# Altium project ideal V2.0.PrjPCB
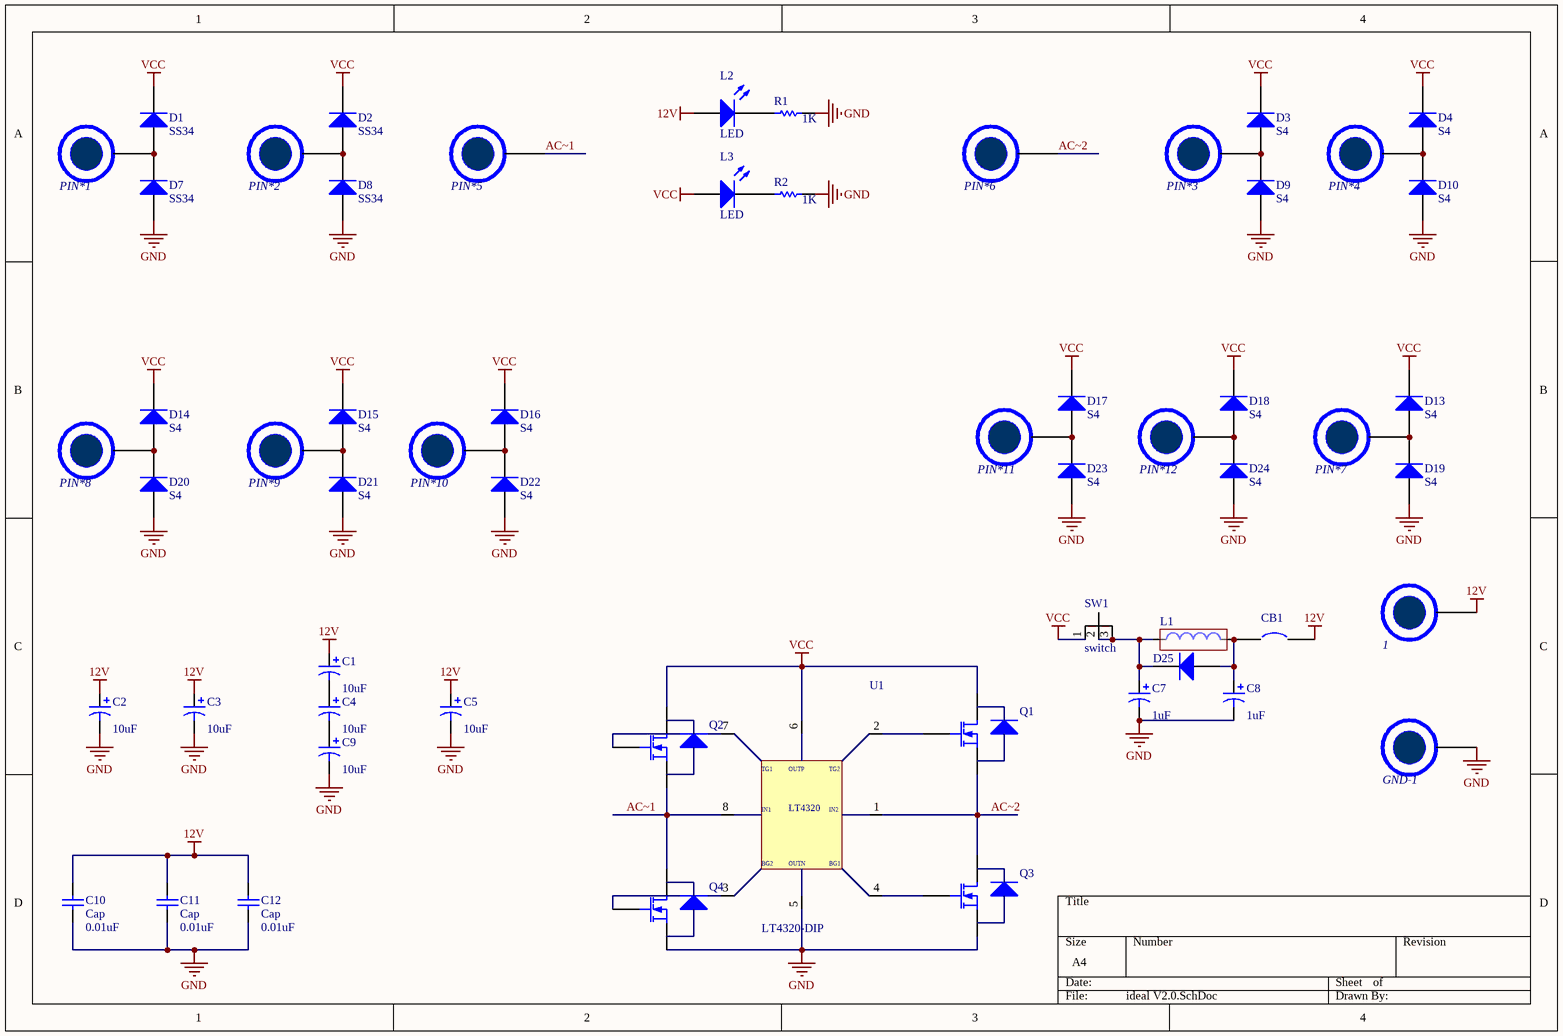
[diagram p0: ideal V2.0.SchDoc]
1 sheet, 58 parts. Net scope: global (net labels, ports and power ports of the same name join across sheets).
Board files: ideal V2.0.PcbDoc, 手工板.PcbDoc

## Sheet ideal V2.0.SchDoc
size A4

### Parts
1  PIN  [PIN]  (value not drawn)
C1  value 10uF  [法拉电容]  (hidden comment: Cap Pol1)
C2  value 10uF  [RB7.6-15]  (hidden comment: Cap Pol1)
C3  value 10uF  [RB7.6-15]  (hidden comment: Cap Pol1)
C4  value 10uF  [法拉电容]  (hidden comment: Cap Pol1)
C5  value 10uF  [RB7.6-15]  (hidden comment: Cap Pol1)
C7  value 1uF  [C2012]  (hidden comment: Cap Pol1)
C8  value 1uF  [C2012]  (hidden comment: Cap Pol1)
C9  value 10uF  [法拉电容]  (hidden comment: Cap Pol1)
C10  Cap  value 0.01uF  [C2012]
C11  Cap  value 0.01uF  [C2012]
C12  Cap  value 0.01uF  [C2012]
CB1  Circuit Breaker  [SPST-2]  (value not drawn)
D1  SS34  [1206(2)]
D2  SS34  [1206(2)]
D3  S4  [1206(2)]
D4  S4  [1206(2)]
D7  SS34  [1206(2)]
D8  SS34  [1206(2)]
D9  S4  [1206(2)]
D10  S4  [1206(2)]
D13  S4  [1206(2)]
D14  S4  [1206(2)]
D15  S4  [1206(2)]
D16  S4  [1206(2)]
D17  S4  [1206(2)]
D18  S4  [1206(2)]
D19  S4  [1206(2)]
D20  S4  [1206(2)]
D21  S4  [1206(2)]
D22  S4  [1206(2)]
D23  S4  [1206(2)]
D24  S4  [1206(2)]
D25  Diode 1N4001  [SK54]  (value not drawn)
GND-1  PIN  [PIN]  (value not drawn)
L1  33uH  [SMD-EC-F16]  (value not drawn)
L2  LED  [C2012]
L3  LED  [C2012]
PIN*1  PIN  [PIN]  (value not drawn)
PIN*2  PIN  [PIN]  (value not drawn)
PIN*3  PIN  [PIN]  (value not drawn)
PIN*4  PIN  [PIN]  (value not drawn)
PIN*5  PIN  [PIN]  (value not drawn)
PIN*6  PIN  [PIN]  (value not drawn)
PIN*7  PIN  [PIN]  (value not drawn)
PIN*8  PIN  [PIN]  (value not drawn)
PIN*9  PIN  [PIN]  (value not drawn)
PIN*10  PIN  [PIN]  (value not drawn)
PIN*11  PIN  [PIN]  (value not drawn)
PIN*12  PIN  [PIN]  (value not drawn)
Q1  MOSFET-N  [mos]  (value not drawn)
Q2  MOSFET-N  [mos]  (value not drawn)
Q3  MOSFET-N  [mos]  (value not drawn)
Q4  MOSFET-N  [mos]  (value not drawn)
R1  value 1K  [R2012]  (hidden comment: Res)
R2  value 1K  [R2012]  (hidden comment: Res)
SW1  switch  [SW-125V6A(-)]
U1  LT4320-DIP  [DIP-8]

### Nets
12V: 1.1(PIN) C1.1 C2.1 C3.1 C5.1 C10.2 C11.2 C12.2 CB1.2 L2.1(A)
GND: C2.2 C3.2 C5.2 C7.2 C8.2 C9.2 C10.1 C11.1 C12.1 D7.1(A) D8.1(A) D9.1(A) D10.1(A) D19.1(A) D20.1(A) D21.1(A) D22.1(A) D23.1(A) D24.1(A) GND-1.1(PIN) Q3.3(S) Q4.3(S) R1.2 R2.2 U1.5
VCC: D1.2(K) D2.2(K) D3.2(K) D4.2(K) D13.2(K) D14.2(K) D15.2(K) D16.2(K) D17.2(K) D18.2(K) L3.1(A) Q1.2(D) Q2.2(D) SW1.1 U1.6
AC~1: PIN*5.1(PIN) Q2.3(S) Q4.2(D) U1.8
AC~2: PIN*6.1(PIN) Q1.3(S) Q3.2(D) U1.1
NetC1_2: C1.2 C4.1
NetC4_2: C4.2 C9.1
NetC7_1: C7.1 D25.2(K) L1.1 SW1.2 SW1.3
NetC8_1: C8.1 CB1.1 D25.1(A) L1.2
NetD1_1: D1.1(A) D7.2(K) PIN*1.1(PIN)
NetD2_1: D2.1(A) D8.2(K) PIN*2.1(PIN)
NetD3_1: D3.1(A) D9.2(K) PIN*3.1(PIN)
NetD4_1: D4.1(A) D10.2(K) PIN*4.1(PIN)
NetD13_1: D13.1(A) D19.2(K) PIN*7.1(PIN)
NetD14_1: D14.1(A) D20.2(K) PIN*8.1(PIN)
NetD15_1: D15.1(A) D21.2(K) PIN*9.1(PIN)
NetD16_1: D16.1(A) D22.2(K) PIN*10.1(PIN)
NetD17_1: D17.1(A) D23.2(K) PIN*11.1(PIN)
NetD18_1: D18.1(A) D24.2(K) PIN*12.1(PIN)
NetL2_2: L2.2(K) R1.1
NetL3_2: L3.2(K) R2.1
NetQ1_1: Q1.1(G) U1.2
NetQ2_1: Q2.1(G) U1.7
NetQ3_1: Q3.1(G) U1.4
NetQ4_1: Q4.1(G) U1.3

### Notes on the sheet
- (in symbol LT4320-DIP) TG1; OUTP; TG2; IN1; LT4320; IN2; BG2; OUTN; BG1

### Library data of the parts
C1-C5 C7-C9 = Cap Pol1: Polarized Capacitor (Radial); Published: 8-Jun-2000; LatestRevisionDate: 17-Jul-2002; LatestRevisionNote: Re-released for DXP Platform.; PackageReference: RB7.6-15; Publisher: Altium Limited; PackageDescription: Polarized Capacitor (Radial); 2 Leads
C10-C12 = Cap: Capacitor; Published: 8-Jun-2000; LatestRevisionDate: 17-Jul-2002; LatestRevisionNote: Re-released for DXP Platform.; PackageReference: RAD-0.3; Publisher: Altium Limited; PackageDescription: Radial Cap, Thru-Hole; 2 Leads; 0.3 in Pin Spacing
D1-D4 D7-D10 D13-D24 = Diode 1N4148: High Conductance Fast Diode; LatestRevisionDate: 17-Jul-2002; LatestRevisionNote: Re-released for DXP Platform.; DatasheetDocument: 1997; PackageReference: DO-35; Publisher: Altium Limited; Code_JEDEC: DO-204-AH; ComponentLink1Description: Manufacturer Link; ComponentLink2Description: Datasheet; ComponentLink2URL: http://www.fairchildsemi.com/ds/1N%2F1N4148.pdf
D25 = Diode 1N4001: 1 Amp General Purpose Rectifier; Published: 8-Jun-2000; LatestRevisionDate: 17-Jul-2002; LatestRevisionNote: Re-released for DXP Platform.; DatasheetVersion: 1998; PackageVersion: Aug-1999; PackageReference: DO-41; Publisher: Altium Limited; PackageDescription: Diode, Axial; Body 5.2 x 2.7 mm (LxDia. max), Lead Dia. 0.86 mm (max); Code_JEDEC: DO-204-AL; ComponentLink1Description: Manufacturer Link; ComponentLink1URL: http://www.fairchildsemi.com/; ComponentLink2Description: Datasheet; ComponentLink2URL: http://www.fairchildsemi.com/ds/1N%2F1N4001.pdf
L1 = Inductor
Q1-Q4 = MOSFET-N: N-Channel MOSFET; PackageDocument: 1995/1996; Published: 8-Jun-2000; LatestRevisionDate: 17-Jul-2002; LatestRevisionNote: Re-released for DXP Platform.; PackageReference: E3; Publisher: Altium Limited
R1 R2 = Res: 贴片电阻; Published: 8-Jun-2000; LatestRevisionDate: 17-Jul-2002; LatestRevisionNote: Re-released for DXP Platform.; PackageReference: AXIAL-0.3; Publisher: Altium Limited
SW1 = small switch: pin to pad: 1>0 2>1 3>2
CB1 = Circuit Breaker: Published: 24-Mar-1999; LatestRevisionDate: 17-Jul-2002; LatestRevisionNote: Re-released for DXP Platform.; PackageReference: SPST-2; Publisher: Altium Limited; PackageDescription: Switch; 2 Leads